# Altium schematic sheet Connectors.SchDoc
size A4; SheetNumber: 3; SheetTotal: 4
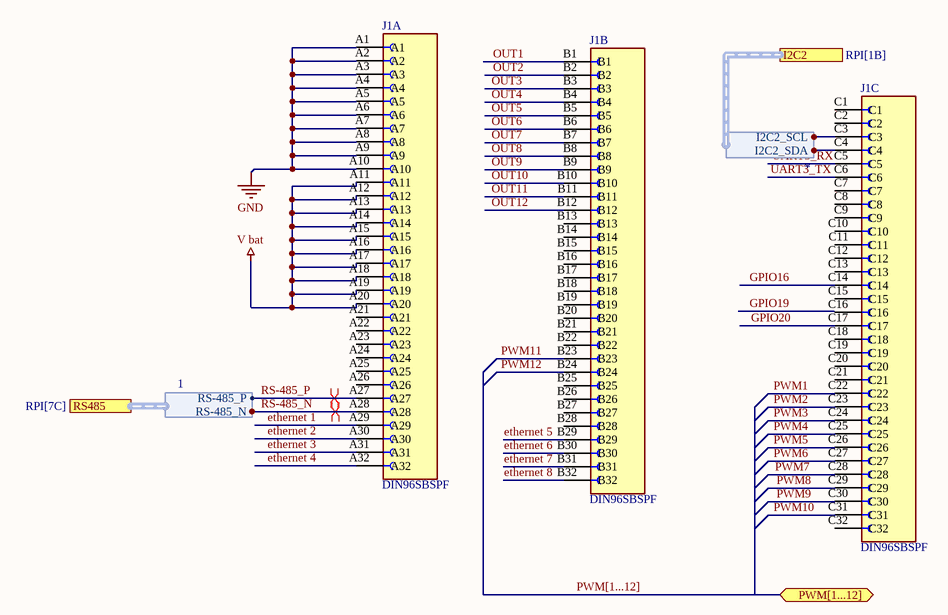
[diagram p0: Connectors.SchDoc]

## Parts
J1  DIN96SBSPF  [CINCH_DIN96SBSPF]  (parts A,B,C of 3)

## Ports
I2C2 (harness *, see RPI[1B]), PWM[1...12] (bidir, see RPI[7A]), RS485 (harness 1, see RPI[7C])

## Harnesses
1: RS-485_P, RS-485_N
*: I2C2_SCL, I2C2_SDA

## Nets
GND: J1.A1 J1.A2 J1.A3 J1.A4 J1.A5 J1.A6 J1.A7 J1.A8 J1.A9 J1.A10
V bat: J1.A11 J1.A12 J1.A13 J1.A14 J1.A15 J1.A16 J1.A17 J1.A18 J1.A19 J1.A20
ethernet 1: J1.A29
ethernet 2: J1.A30
ethernet 3: J1.A31
ethernet 4: J1.A32
ethernet 5: J1.B29
ethernet 6: J1.B30
ethernet 7: J1.B31
ethernet 8: J1.B32
GPIO16: J1.C14
GPIO20: J1.C17
OUT1: J1.B1
OUT2: J1.B2
OUT3: J1.B3
OUT4: J1.B4
OUT5: J1.B5
OUT6: J1.B6
OUT7: J1.B7
OUT8: J1.B8
OUT9: J1.B9
OUT10: J1.B10
OUT11: J1.B11
OUT12: J1.B12
PWM1: J1.C22
PWM2: J1.C23
PWM3: J1.C24
PWM4: J1.C25
PWM5: J1.C26
PWM6: J1.C27
PWM7: J1.C28
PWM8: J1.C29
PWM9: J1.C30
PWM10: J1.C31
PWM11: J1.B23
PWM12: J1.B24
RS-485_N: J1.A28 ; port RS485.RS-485_N
RS-485_P: J1.A27 ; port RS485.RS-485_P
UART3_RX: J1.C5
UART3_TX: J1.C6
NetJ1_C3: J1.C3 ; port I2C2.I2C2_SCL
NetJ1_C4: J1.C4 ; port I2C2.I2C2_SDA

Not connected (* = marked no-connect by the designer): J1 A21 A22 A23 A24 A25 A26 B13 B14 B15 B16 B17 B18 B19 B20 B21 B22 B25 B26 B27 B28 C1 C2 C7 C8 C9 C10 C11 C12 C13 C15 C16 C18 C19 C20 C21 C32

## Buses and harness runs
bus PWM[1...12] = port PWM[1...12]

## Layout directives
differential pair: RS-485_N, RS-485_P

## Library data of the parts
J1 = DIN96SBSPF: DIN 41612 socket, fully populated, 96 contacts, straight PCB mounted, press-fit pins; MF: Cinch Connectivity Solutions; Package: None; Price: None; Check_prices: https://www.snapeda.com/parts/DIN96SBSPF/Cinch+Connectivity+Solutions/view-part/?ref=eda; Value: *; SnapEDA_Link: https://www.snapeda.com/parts/DIN96SBSPF/Cinch+Connectivity+Solutions/view-part/?ref=snap; MP: DIN96SBSPF; Availability: In Stock; Purchase-URL: https://pricing.snapeda.com/search?q=DIN96SBSPF&ref=eda